# Altium project AT Guard Simple.PrjPcb
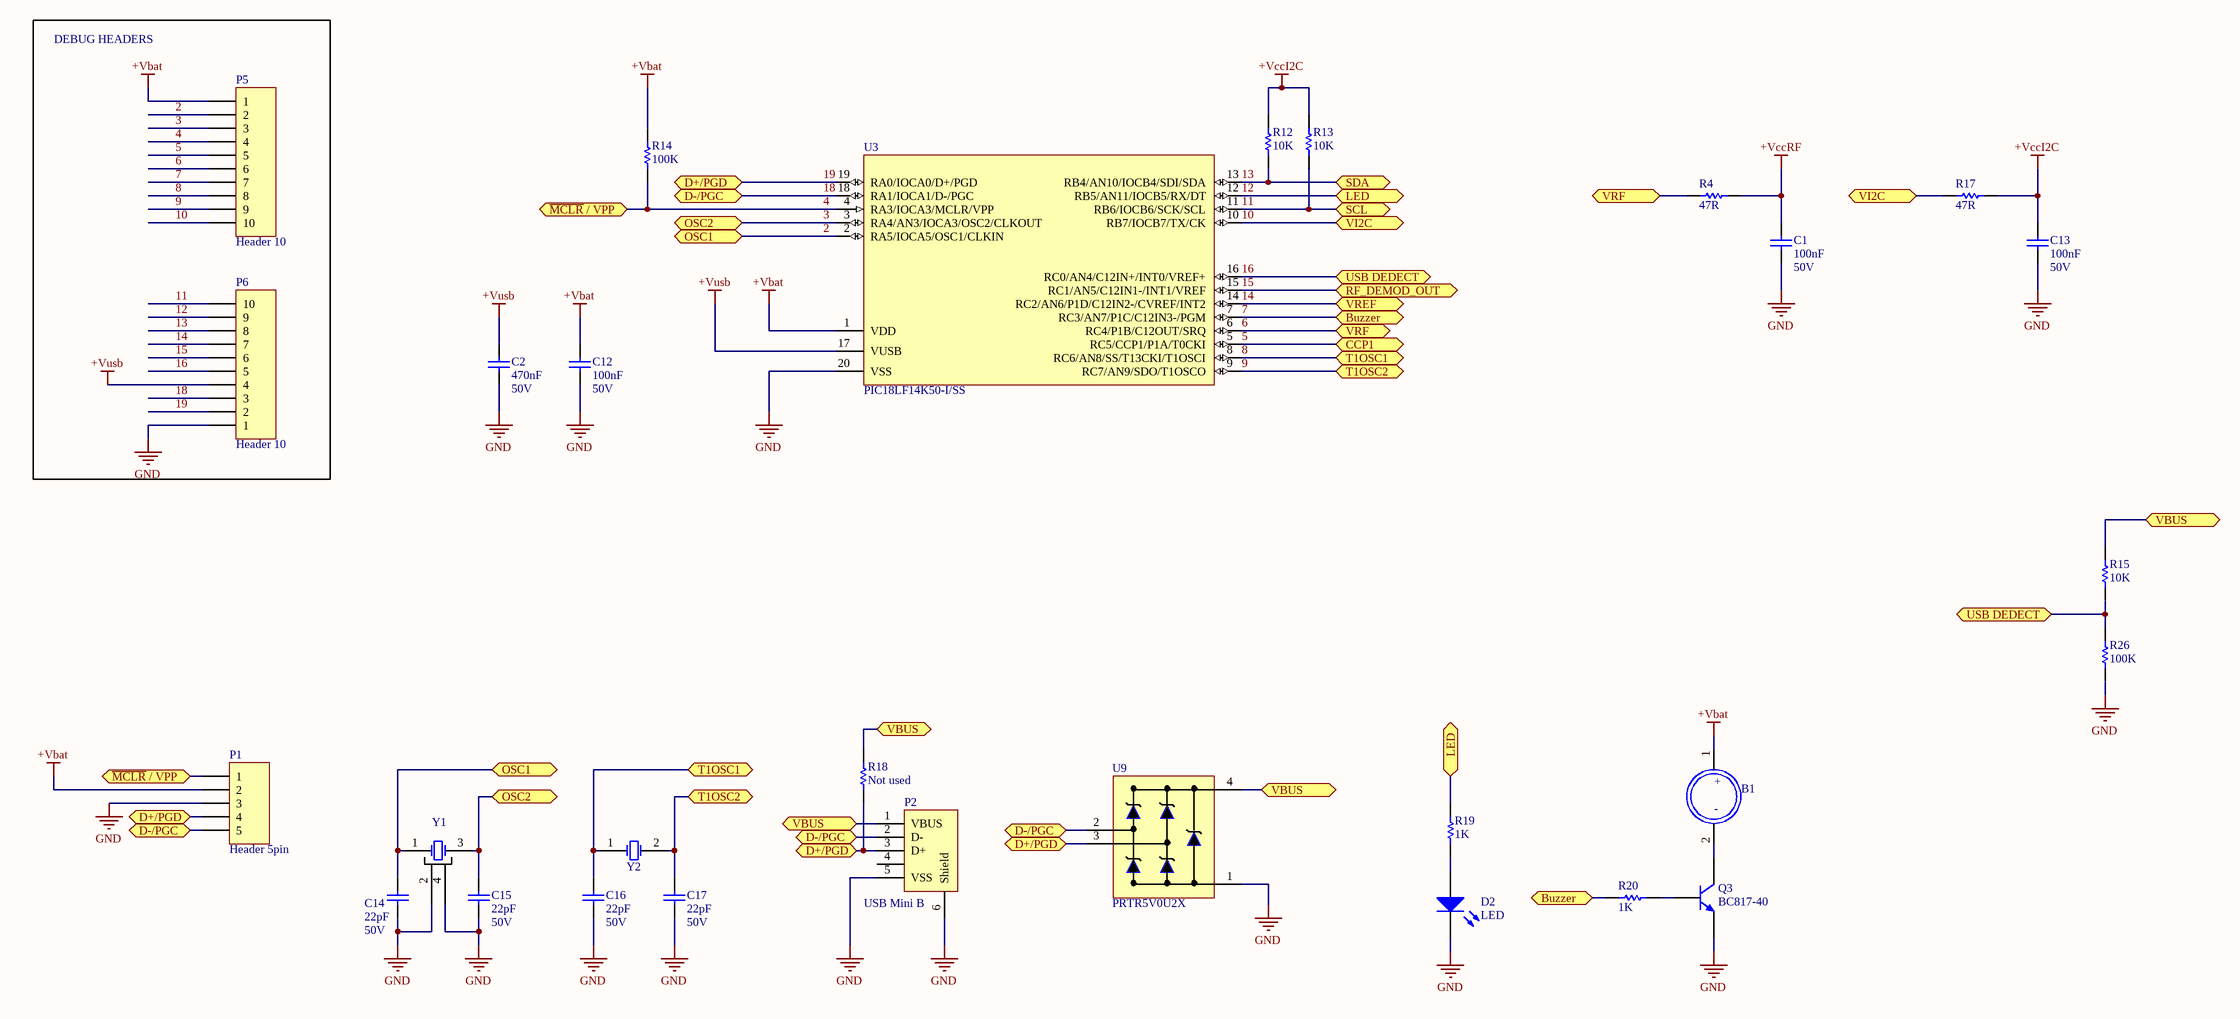
[diagram p0: AT Guard Simple Main.SchDoc]
6 sheets, 82 parts. Net scope: flat (ports and power ports of the same name join across sheets).
Board files: ATGuard Simple V52.PcbDoc, ATGuard Simple V52 Panel.PcbDoc
Sheets:
  AT Guard Simple Main.SchDoc
  RF_125KHz.SchDoc
  AT Guard Simple Power.SchDoc
  AT Guard Simple RTC.SchDoc
  AT Guard Simple Memory.SchDoc
  AT Guard Simple Mems.SchDoc

## Sheet AT Guard Simple Main.SchDoc
size C

### Parts
B1  Buzzer 5V r=12mm, h=7.5 mm  [Buzzer 9x5.5 mm]  (value not drawn)
C1  value 100nF  Voltage: 50V  [3-0603_N]  (hidden comment: Cap)
C2  value 470nF  Voltage: 50V  [3-0603_L]  (hidden comment: Cap)
C12  value 100nF  Voltage: 50V  [3-0603_L]  (hidden comment: Cap)
C13  value 100nF  Voltage: 50V  [3-0603_L]  (hidden comment: Cap)
C14  value 22pF  Voltage: 50V  [3-0603_L]  (hidden comment: Cap)
C15  value 22pF  Voltage: 50V  [3-0603_L]  (hidden comment: Cap)
C16  value 22pF  Voltage: 50V  [3-0603_L]  (hidden comment: Cap)
C17  value 22pF  Voltage: 50V  [3-0603_L]  (hidden comment: Cap)
D2  LED  [6-0805 - LED]
P1  Header 5pin  [Header 1.27mm 5P]
P2  USB Mini B  [USB Mini B Female_N 2]
P5  Header 10  [Header 1.27mm 10P]
P6  Header 10  [Header 1.27mm 10P]
Q3  BC817-40  [SOT23_N]
R4  value 47R  [3-0603_N]  (hidden comment: Res1)
R12  value 10K  [3-0603_L]  (hidden comment: Res1)
R13  value 10K  [3-0603_L]  (hidden comment: Res1)
R14  value 100K  [3-0603_L]  (hidden comment: Res1)
R15  value 10K  [3-0603_L]  (hidden comment: Res1)
R17  value 47R  [3-0603_L]  (hidden comment: Res1)
R18  value Not used  [3-0603_L]  (hidden comment: Res1)
R19  value 1K  [3-0603_L]  (hidden comment: Res1)
R20  value 1K  [3-0603_L]  (hidden comment: Res1)
R26  value 100K  [3-0603_L]  (hidden comment: Res1)
U3  PIC18LF14K50-I/SS  [SSOP-20]
U9  PRTR5V0U2X  [SOT-143B]
Y1  Crystal Oscillator  [4x2.5mm & 3.2x2.5 mm SMD CRYSTAL - duplicate]  (value not drawn)
Y2  XTAL_SMT  [32768 SMT 2.1x6.2mm Crystal]  (value not drawn)

### Blocks framed on the sheet
DEBUG HEADERS: P5 P6

### Ports
Buzzer (bidir), CCP1 (bidir), D+/PGD (bidir), D-/PGC (bidir), LED (bidir), OSC1 (bidir), OSC2 (bidir), RF_DEMOD_OUT (bidir), SCL (bidir), SDA (bidir), T1OSC1 (bidir), T1OSC2 (bidir), USB DEDECT (bidir), VBUS, VI2C (bidir), VREF (bidir), VRF (bidir), ~{MCLR} / VPP (bidir)

### Nets
+Vbat: B1.1 C12.2 P1.2 P5.1 R14.2 U3.1(VDD)
+VccI2C: C13.2 R12.2 R13.2 R17.2
+VccRF: C1.2 R4.2
+Vusb: C2.2 P6.4 U3.17(VUSB)
GND: C1.1 C2.1 C12.1 C13.1 C14.1 C15.1 C16.1 C17.1 D2.2(K) P1.3 P2.5(VSS) P2.6(Shield) P6.1 Q3.2(E) R26.1 U3.20(VSS) U9.1 Y1.2(GND) Y1.4(GND)
2: C14.2 P5.2 U3.2(RA5/IOCA5/OSC1/CLKIN) Y1.1(OSC1) ; port OSC1
3: C15.2 P5.3 U3.3(RA4/AN3/IOCA3/OSC2/CLKOUT) Y1.3(OSC2) ; port OSC2
4: P1.1 P5.4 R14.1 U3.4(RA3/IOCA3/MCLR/VPP) ; port ~{MCLR} / VPP
5: P5.5 U3.5(RC5/CCP1/P1A/T0CKI) ; port CCP1
6: P5.6 R4.1 U3.6(RC4/P1B/C12OUT/SRQ) ; port VRF
7: P5.7 R20.2 U3.7(RC3/AN7/P1C/C12IN3-/PGM) ; port Buzzer
8: C16.2 P5.8 U3.8(RC6/AN8/SS/T13CKI/T1OSCI) Y2.1(OSC1) ; port T1OSC1
9: C17.2 P5.9 U3.9(RC7/AN9/SDO/T1OSCO) Y2.2(OSC2) ; port T1OSC2
10: P5.10 R17.1 U3.10(RB7/IOCB7/TX/CK) ; port VI2C
11: P6.10 R13.1 U3.11(RB6/IOCB6/SCK/SCL) ; port SCL
12: P6.9 R19.2 U3.12(RB5/AN11/IOCB5/RX/DT) ; port LED
13: P6.8 R12.1 U3.13(RB4/AN10/IOCB4/SDI/SDA) ; port SDA
14: P6.7 U3.14(RC2/AN6/P1D/C12IN2-/CVREF/INT2) ; port VREF
15: P6.6 U3.15(RC1/AN5/C12IN1-/INT1/VREF) ; port RF_DEMOD_OUT
16: P6.5 R15.1 R26.2 U3.16(RC0/AN4/C12IN+/INT0/VREF+) ; port USB DEDECT
18: P1.5 P2.2(D-) P6.3 U3.18(RA1/IOCA1/D-/PGC) U9.2 ; port D-/PGC
19: P1.4 P2.3(D+) P6.2 R18.1 U3.19(RA0/IOCA0/D+/PGD) U9.3 ; port D+/PGD
NetB1_2: B1.2 Q3.3(C)
NetD2_1: D2.1(A) R19.1
NetD5_1: P2.1(VBUS) R15.2 R18.2 U9.4 ; port VBUS
NetQ3_1: Q3.1(B) R20.1

Not connected (* = marked no-connect by the designer): P2 4

### Notes on the sheet
- (in symbol Buzzer_) +; -

### Library data of the parts
B1 = Buzzer_
C1 C2 C12-C17 = Cap: Capacitor; Published: 8-Jun-2000; Revision: July-2002: Re-released for DXP Platform.; Publisher: Altium Limited
D2 = LED: Typical INFRARED GaAs LED; Published: 8-Jun-2000; LatestRevisionDate: 08-Jul-2005; LatestRevisionNote: Mech Layer 1 removed.; PackageReference: LED-0; Publisher: Altium Limited
P1 = Header 5 pin: Header 5-Pin; LatestRevisionDate: 17-Jul-2002; LatestRevisionNote: Re-released for DXP Platform.; Publisher: Altium Limited
P5 P6 = Header 10: Header, 10-Pin; LatestRevisionDate: 17-Jul-2002; LatestRevisionNote: Re-released for DXP Platform.; Publisher: Altium Limited
Q3 = BC817-40: NPN General-purpose Transistor; Published: 17-Sep-2003; LatestRevisionDate: 12-Dec-2006; LatestRevisionNote: IPC-7351 Footprint Added.; DatasheetVersion: Jun-1999; PackageVersion: May-1999; PackageReference: SOT23; Publisher: Altium Limited; PackageDescription: 3-Pin SOT-23 Package 0.95 mm Pitch, 2.3 mm Lead Span; ComponentLink1Description: Manufacturer Link; ComponentLink1URL: http://www.semiconductors.philips.com/; ComponentLink2Description: Datasheet; ComponentLink2URL: http://www.semiconductors.philips.com/acrobat/datasheets/BC817_BC817W_BC337_5.pdf
R4 R12-R15 R17-R20 R26 = Res1: Resistor; Published: 8-Jun-2000; LatestRevisionDate: 17-Jul-2002; LatestRevisionNote: Re-released for DXP Platform.; PackageReference: AXIAL-0.3; Publisher: Altium Limited
U3 = PIC18LF14K50-I/SS: High Performance, Enhanced FLASH Microcontroller with 10-Bit A/D and nanoWatt Technology, 8K FLASH, 20-Pin SSOP, Standard Volt Range, Industrial Temperature; Note: OSC1, OSC2, CLKI and CLKO are only available in select Oscillator modes and when these pins are not being used as digital I/O.; Published: 11-Oct-2004; LatestRevisionDate: 04-Mar-2005; LatestRevisionNote: Stylized 3D Model Added.; DatasheetVersion: DS39605B_2002; PackageVersion: 2003; PackageReference: SSOP-20; Publisher: Altium Limited; PackageDescription: SSOP, Plastic; 20 Leads; Body Width 5.3 mm; Pitch 0.65 mm; Code_JEDEC: MO-150; ComponentLink1Description: Manufacturer Link; ComponentLink1URL: http://www.microchip.com; ComponentLink2Description: Datasheet; ComponentLink2URL: http://ww1.microchip.com/downloads/en/DeviceDoc/39605b.pdf; ComponentLink3Description: Packaging Specification; ComponentLink3URL: http://ww1.microchip.com/downloads/en/PackagingSpec/00049AD.pdf
U9 = PRTR5V0U2X: Ultra low capacitance double rail-to-rail ESD protection diode; Published: 13-Oct-2000; LatestRevisionDate: 06-Jun-2005; LatestRevisionNote: Stylized 3D Model Added.; DatasheetVersion: 10-Aug-1999; PackageVersion: 1999; PackageReference: DIP8; Publisher: Altium Limited; PackageDescription: DIP; 8 Leads; Row Spacing 7.62 mm; Pitch 2.54 mm; ComponentLink1Description: Manufacturer Link; ComponentLink1URL: http://www.maxim-ic.com/; ComponentLink2Description: Datasheet; ComponentLink2URL: http://pdfserv.maxim-ic.com/en/ds/DS1307.pdf; ComponentLink3Description: Discontinuation Notice; ComponentLink3URL: http://www.maxim-ic.com/qa/pdfs/non-obsolescence-letter.pdf
Y1 = Crystal Oscillator: Value: 12MHz; Published: 8-Jun-2000; LatestRevisionDate: 17-Jul-2002; LatestRevisionNote: Re-released for DXP Platform.; PackageReference: R38; Publisher: Altium Limited
Y2 = XTAL_SMT: Crystal Oscillator; Published: 8-Jun-2000; LatestRevisionDate: 17-Jul-2002; LatestRevisionNote: Re-released for DXP Platform.; PackageReference: R38; Publisher: Altium Limited
P2 = USB Mini B: LatestRevisionDate: 17-Jul-2002; LatestRevisionNote: Re-released for DXP Platform.; Publisher: Altium Limited

## Sheet RF_125KHz.SchDoc
size D
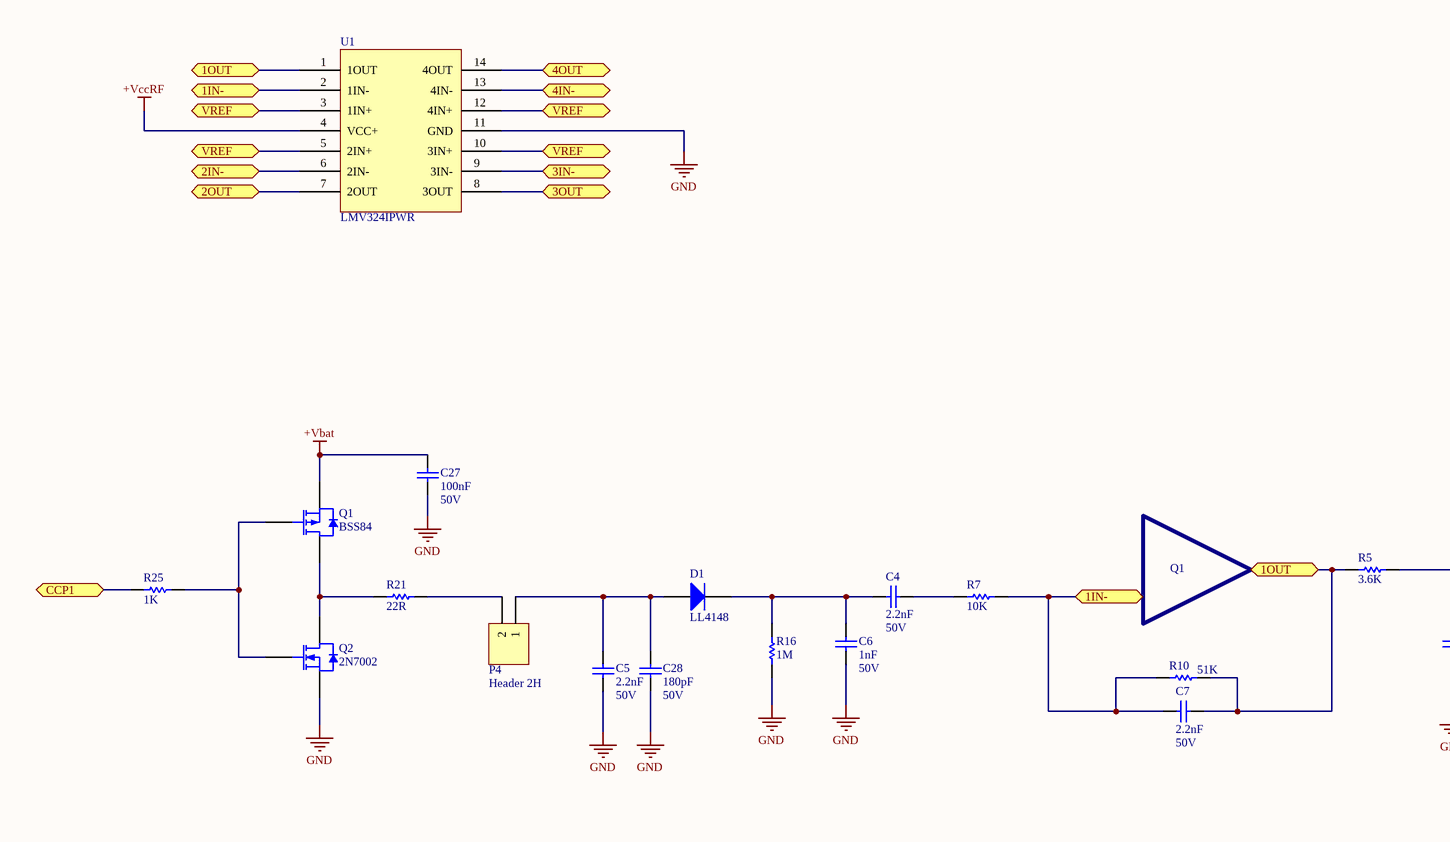
[diagram p1: RF_125KHz.SchDoc, left]
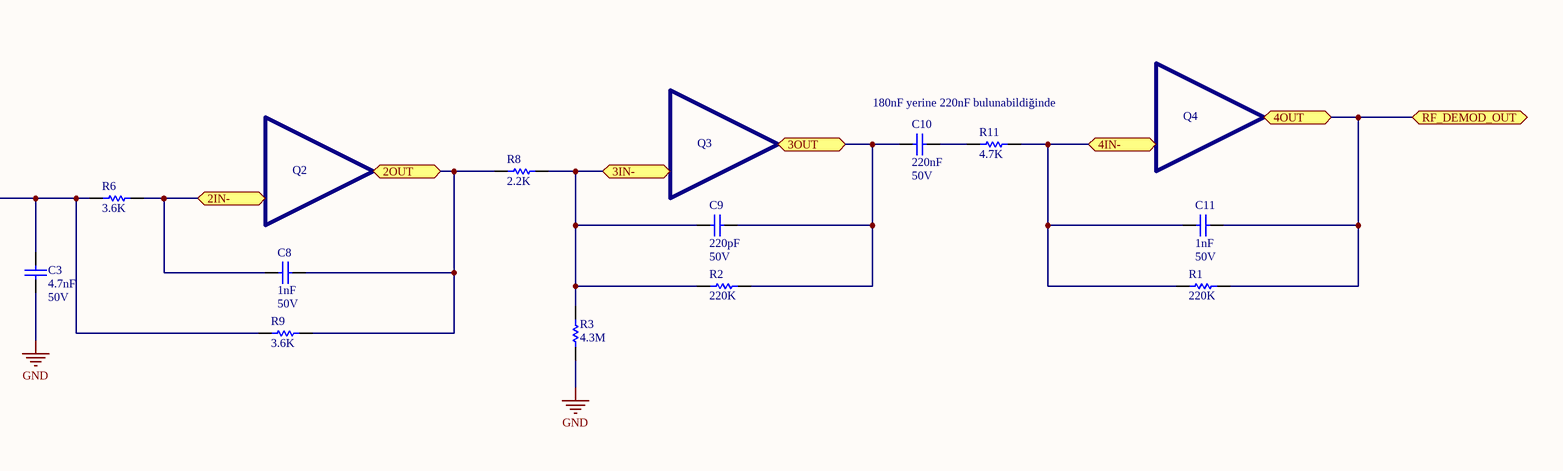
[diagram p2: RF_125KHz.SchDoc, right]

### Parts
C3  value 4.7nF  Voltage: 50V  [6-0805_N]  (hidden comment: Cap)
C4  value 2.2nF  Voltage: 50V  [6-0805_N]  (hidden comment: Cap)
C5  value 2.2nF  Voltage: 50V  [6-0805_N]  (hidden comment: Cap)
C6  value 1nF  Voltage: 50V  [6-0805_N]  (hidden comment: Cap)
C7  value 2.2nF  Voltage: 50V  [6-0805_N]  (hidden comment: Cap)
C8  value 1nF  Voltage: 50V  [6-0805_N]  (hidden comment: Cap)
C9  value 220pF  Voltage: 50V  [6-0805_N]  (hidden comment: Cap)
C10  value 220nF  Voltage: 50V  [6-0805_N]  (hidden comment: Cap)
C11  value 1nF  Voltage: 50V  [6-0805_N]  (hidden comment: Cap)
C27  value 100nF  Voltage: 50V  [3-0603_N]  (hidden comment: Cap)
C28  value 180pF  Voltage: 50V  [6-0805_N]  (hidden comment: Cap)
D1  LL4148  [DL-35 - S]
P4  Header 2H  [HDR1X2H-180 derece]
Q1  BSS84  [SOT23_N]
Q2  2N7002  [SOT23_N]
R1  value 220K  [6-0805_N]  (hidden comment: Res1)
R2  value 220K  [6-0805_N]  (hidden comment: Res1)
R3  value 4.3M  [6-0805_N]  (hidden comment: Res1)
R5  value 3.6K  [6-0805_N]  (hidden comment: Res1)
R6  value 3.6K  [6-0805_N]  (hidden comment: Res1)
R7  value 10K  [6-0805_N]  (hidden comment: Res1)
R8  value 2.2K  [6-0805_N]  (hidden comment: Res1)
R9  value 3.6K  [6-0805_N]  (hidden comment: Res1)
R10  value 51K  [6-0805_N]  (hidden comment: Res1)
R11  value 4.7K  [6-0805_N]  (hidden comment: Res1)
R16  value 1M  [6-0805_N]  (hidden comment: Res1)
R21  value 22R  [6-0805_N]  (hidden comment: Res1)
R25  value 1K  [3-0603_N]  (hidden comment: Res1)
U1  LMV324IPWR  [TSSOP-14N]

### Ports
1IN-, 1OUT, 2IN-, 2OUT, 3IN-, 3OUT, 4IN-, 4OUT (bidir), CCP1 (bidir), RF_DEMOD_OUT (bidir), VREF (bidir)

### Nets
+Vbat: C27.2 Q1.2(S)
+VccRF: U1.4(VCC+)
GND: C3.1 C5.2 C6.2 C27.1 C28.2 Q2.2(S) R3.2 R16.1 U1.11(GND)
5: R25.1 ; port CCP1
14: U1.3(1IN+) U1.5(2IN+) U1.10(3IN+) U1.12(4IN+) ; port VREF
15: C11.2 R1.2 U1.14(4OUT) ; port 4OUT, port RF_DEMOD_OUT
NetC3_2: C3.2 R5.1 R6.2 R9.2
NetC4_1: C4.1 R7.2
NetC4_2: C4.2 C6.1 D1.2(K) R16.2
NetC5_1: C5.1 C28.1 D1.1(A) P4.1
NetC7_1: C7.1 R7.1 R10.2 U1.2(1IN-) ; port 1IN-
NetC7_2: C7.2 R5.2 R10.1 U1.1(1OUT) ; port 1OUT
NetC8_1: C8.1 R6.1 U1.6(2IN-) ; port 2IN-
NetC8_2: C8.2 R8.2 R9.1 U1.7(2OUT) ; port 2OUT
NetC9_1: C9.1 R2.2 R3.1 R8.1 U1.9(3IN-) ; port 3IN-
NetC9_2: C9.2 C10.1 R2.1 U1.8(3OUT) ; port 3OUT
NetC10_2: C10.2 R11.1
NetC11_1: C11.1 R1.1 R11.2 U1.13(4IN-) ; port 4IN-
NetP4_2: P4.2 R21.2
NetQ1_1: Q1.1(G) Q2.1(G) R25.2
NetQ1_3: Q1.3(D) Q2.3(D) R21.1

### Notes on the sheet
- 180nF yerine 220nF bulunabildiğinde
- Q2
- Q3
- Q4
- Q1

### Library data of the parts
C3-C11 C27 C28 = Cap: Capacitor; Published: 8-Jun-2000; Revision: July-2002: Re-released for DXP Platform.; Publisher: Altium Limited
D1 = LL4148: 1 Amp General Purpose Rectifier; Published: 8-Jun-2000; LatestRevisionDate: 17-Jul-2002; LatestRevisionNote: Re-released for DXP Platform.; DatasheetDocument: 1998; PackageDocument: Aug-1999; Publisher: Altium Limited; Code_JEDEC: DO-204-AL; ComponentLink1Description: Manufacturer Link; ComponentLink1URL: http://www.fairchildsemi.com/; ComponentLink2Description: Datasheet; ComponentLink2URL: http://www.fairchildsemi.com/ds/1N%2F1N4001.pdf
P4 = Header 2H: Header, 2-Pin, Right Angle; LatestRevisionDate: 17-Jul-2002; LatestRevisionNote: Re-released for DXP Platform.; Publisher: Altium Limited
Q1 = BSS84: P-channel Enhancement Mode Vertical D-MOSFET; Published: 17-Sep-2003; LatestRevisionDate: 12-Dec-2006; LatestRevisionNote: IPC-7351 Footprint Added.; DatasheetVersion: 18-Jun-1997; PackageVersion: May-1999; PackageReference: SOT23; Publisher: Altium Limited; PackageDescription: 3-Pin SOT-23 Package 0.95 mm Pitch, 2.3 mm Lead Span; ComponentLink1Description: Manufacturer Link; ComponentLink1URL: http://www.semiconductors.philips.com/; ComponentLink2Description: Datasheet; ComponentLink2URL: http://www.semiconductors.philips.com/acrobat/datasheets/BSS84_3.pdf
Q2 = 2N7002: N-channel Enhancement Mode Field-effect Transistor; Published: 17-Sep-2003; LatestRevisionDate: 12-Dec-2006; LatestRevisionNote: IPC-7351 Footprint Added.; DatasheetVersion: 27-Jul-2000; PackageVersion: May-1999; PackageReference: SOT23; Publisher: Altium Limited; PackageDescription: 3-Pin SOT-23 Package 0.95 mm Pitch, 2.3 mm Lead Span; ComponentLink1Description: Manufacturer Link; ComponentLink1URL: http://www.semiconductors.philips.com/; ComponentLink2Description: Datasheet; ComponentLink2URL: http://www.semiconductors.philips.com/acrobat/datasheets/2N7002_4.pdf
R1-R3 R5-R11 R16 R21 R25 = Res1: Resistor; Published: 8-Jun-2000; LatestRevisionDate: 17-Jul-2002; LatestRevisionNote: Re-released for DXP Platform.; PackageReference: AXIAL-0.3; Publisher: Altium Limited
U1 = LMV324IPWR: IC OPAMP GP R-R 1MHZ 14TSSOP; Manufacturer: Texas Instruments; .Checked PCB: *; .Checked SCH: *; Category: Integrated Circuits (ICs); Digi-Key Part Number: 296-9570-2-ND; Manufacturer Part Number: LMV324IPWR; Package / Case: 14-TSSOP (0.173", 4.40mm Width); Family: Linear - Amplifiers - Instrumentation, OP Amps, Buffer Amps; Price 1k [$]: 0.14375; Standard Package: 2000

## Sheet AT Guard Simple Power.SchDoc
size A
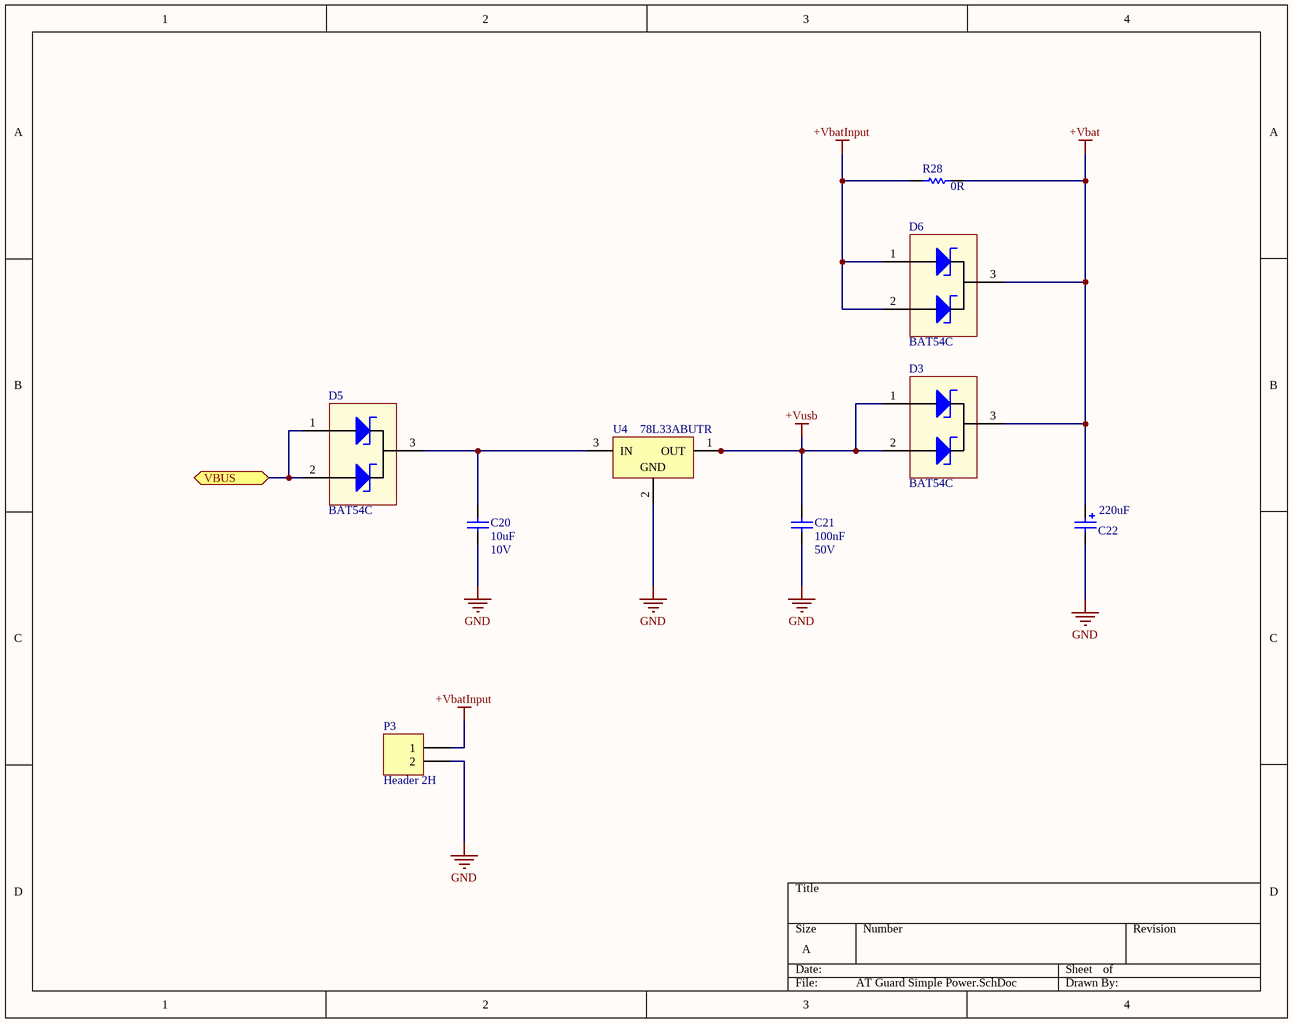
[diagram p3: AT Guard Simple Power.SchDoc]

### Parts
C20  value 10uF  Voltage: 10V  [3-0603_L]  (hidden comment: Cap)
C21  value 100nF  Voltage: 50V  [3-0603_L]  (hidden comment: Cap)
C22  value 220uF  [C]  (hidden comment: CAP-Tantal)
D3  BAT54C  [SOT23_N]
D5  BAT54C  [SOT23_N]
D6  BAT54C  [SOT23_N]
P3  Header 2H  [HDR1X2H-180 derece]
R28  value 0R  [6-0805_N]  (hidden comment: Res1)
U4  78L33ABUTR  [SOT89M]

### Ports
VBUS

### Nets
+Vbat: C22.1 D3.3(A) D6.3(A) R28.2
+VbatInput: D6.1(K1) D6.2(K2) P3.1 R28.1
+Vusb: C21.2 D3.1(K1) D3.2(K2) U4.1(OUT)
GND: C20.1 C21.1 C22.2 P3.2 U4.2(GND)
NetC20_2: C20.2 D5.3(A) U4.3(IN)
NetD5_1: D5.1(K1) D5.2(K2) ; port VBUS

### Library data of the parts
C20 C21 = Cap: Capacitor; Published: 8-Jun-2000; Revision: July-2002: Re-released for DXP Platform.; Publisher: Altium Limited
C22 = CAP-Tantal: Tantamount Military, Surface Mount MIL-PRF-55365/8 Qualified Solid Tantalum Chip Capacitor: 6.8uF, 20% Tolerance, 6 WVDC @ +85°C, Surge = 8V; Note: See Data Sheet for full range of components; Voltage: 6.3V; Published: 19-Mar-2004; DatasheetDocument: 20-Mar-2003; PackageReference: 3528; Publisher: Altium Limited; Code_JEITA: 3528; ComponentLink1Description: Manufacturer Link; ComponentLink1URL: http://www.vishay.com/; ComponentLink2Description: Datasheet; ComponentLink2URL: http://www.vishay.com/docs/40011/cwr11.pdf
D3 D5 D6 = BAT54C: 2x200 mA Shottky Rectifier; Published: 8-Jun-2000; LatestRevisionDate: 17-Jul-2002; LatestRevisionNote: Re-released for DXP Platform.; DatasheetDocument: 1998; PackageDocument: Aug-1999; PackageReference: DO-41; Publisher: Altium Limited; Code_JEDEC: DO-204-AL; ComponentLink1Description: Manufacturer Link; ComponentLink1URL: http://www.fairchildsemi.com/; ComponentLink2Description: Datasheet; ComponentLink2URL: http://www.fairchildsemi.com/ds/1N%2F1N4001.pdf
P3 = Header 2H: Header, 2-Pin, Right Angle; LatestRevisionDate: 17-Jul-2002; LatestRevisionNote: Re-released for DXP Platform.; Publisher: Altium Limited
R28 = Res1: Resistor; Published: 8-Jun-2000; LatestRevisionDate: 17-Jul-2002; LatestRevisionNote: Re-released for DXP Platform.; PackageReference: AXIAL-0.3; Publisher: Altium Limited
U4 = 78L33ABUTR: Precision 500mA Regulator; Published: 24-Aug-2001; LatestRevisionDate: 06-Jun-2005; LatestRevisionNote: PCB pads lengthened.; DatasheetVersion: Mar-1997; PackageVersion: Jun-2004; PackageReference: TO-252; Publisher: Altium Limited; PackageDescription: D-PAK/TO-252-AA; 3 Leads (1 Cropped); Body 10.1 (inc. leads) x 6.6 mm (LxW max); ComponentLink1Description: Manufacturer Link; ComponentLink1URL: http://www.st.com/; ComponentLink2Description: Datasheet; ComponentLink2URL: http://www.st.com/stonline/products/literature/ds/2147/l78m05ab.pdf

## Sheet AT Guard Simple RTC.SchDoc
size A4
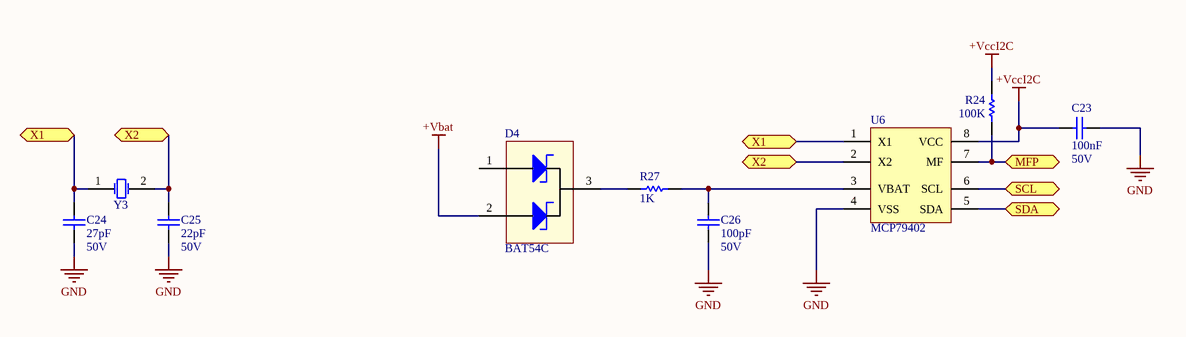
[diagram p4: AT Guard Simple RTC.SchDoc]

### Parts
C23  value 100nF  Voltage: 50V  [3-0603_L]  (hidden comment: Cap)
C24  value 27pF  Voltage: 50V  [3-0603_L]  (hidden comment: Cap)
C25  value 22pF  Voltage: 50V  [3-0603_L]  (hidden comment: Cap)
C26  value 100pF  Voltage: 50V  [3-0603_L]  (hidden comment: Cap)
D4  BAT54C  [SOT23_N]
R24  value 100K  [3-0603_L]  (hidden comment: Res1)
R27  value 1K  [3-0603_L]  (hidden comment: Res1)
U6  MCP79402  [TSSOP-ST8_M]
Y3  XTAL_SMT  [32768 SMT 2.1x6.2mm Crystal]  (value not drawn)

### Ports
MFP (bidir), SCL (bidir), SDA (bidir), X1, X2

### Nets
+Vbat: D4.2(K2)
+VccI2C: C23.1 R24.1 U6.8(VCC)
GND: C23.2 C24.1 C25.1 C26.1 U6.4(VSS)
11: U6.6(SCL) ; port SCL
13: U6.5(SDA) ; port SDA
NetC24_2: C24.2 U6.1(X1) Y3.1(OSC1) ; port X1
NetC25_2: C25.2 U6.2(X2) Y3.2(OSC2) ; port X2
NetC26_2: C26.2 R27.2 U6.3(VBAT)
NetD4_3: D4.3(A) R27.1
NetR24_2: R24.2 U6.7(MF) ; port MFP

Not connected (* = marked no-connect by the designer): D4 1(K1)

### Library data of the parts
C23-C26 = Cap: Capacitor; Published: 8-Jun-2000; Revision: July-2002: Re-released for DXP Platform.; Publisher: Altium Limited
D4 = BAT54C: 2x200 mA Shottky Rectifier; Published: 8-Jun-2000; LatestRevisionDate: 17-Jul-2002; LatestRevisionNote: Re-released for DXP Platform.; DatasheetDocument: 1998; PackageDocument: Aug-1999; PackageReference: DO-41; Publisher: Altium Limited; Code_JEDEC: DO-204-AL; ComponentLink1Description: Manufacturer Link; ComponentLink1URL: http://www.fairchildsemi.com/; ComponentLink2Description: Datasheet; ComponentLink2URL: http://www.fairchildsemi.com/ds/1N%2F1N4001.pdf
R24 R27 = Res1: Resistor; Published: 8-Jun-2000; LatestRevisionDate: 17-Jul-2002; LatestRevisionNote: Re-released for DXP Platform.; PackageReference: AXIAL-0.3; Publisher: Altium Limited
U6 = MCP79402: MCP79402 RTC,I2C; Published: 29-Jan-2009; DatasheetVersion: revE, Mar-2007; PackageVersion: revAW, Oct-2008; PackageReference: SOIJ-SM8; Publisher: Altium Limited; PackageDescription: 8-Lead Plastic Small Outline (SM) - Medium, 5.28 mm Body [SOIJ]; ComponentLink1Description: Manufacturer Link; ComponentLink1URL: http://www.microchip.com; ComponentLink2Description: Datasheet; ComponentLink2URL: http://ww1.microchip.com/downloads/en/DeviceDoc/21941E.pdf; ComponentLink3Description: Packaging Specification; ComponentLink3URL: http://ww1.microchip.com/downloads/en/PackagingSpec/00049AW.pdf
Y3 = XTAL_SMT: Crystal Oscillator; Published: 8-Jun-2000; LatestRevisionDate: 17-Jul-2002; LatestRevisionNote: Re-released for DXP Platform.; PackageReference: R38; Publisher: Altium Limited

## Sheet AT Guard Simple Memory.SchDoc
size A4
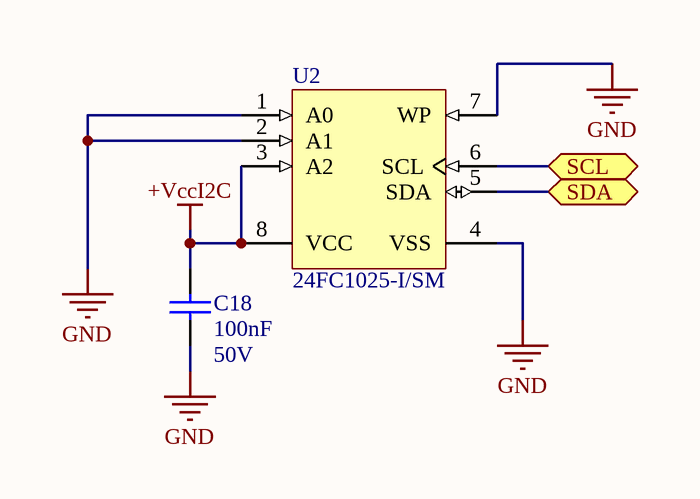
[diagram p5: AT Guard Simple Memory.SchDoc]

### Parts
C18  value 100nF  Voltage: 50V  [3-0603_L]  (hidden comment: Cap)
U2  24FC1025-I/SM  [SOIJ-SM8_N]

### Ports
SCL (bidir), SDA (bidir)

### Nets
+VccI2C: C18.2 U2.3(A2) U2.8(VCC)
GND: C18.1 U2.1(A0) U2.2(A1) U2.4(VSS) U2.7(WP)
11: U2.6(SCL) ; port SCL
13: U2.5(SDA) ; port SDA

### Library data of the parts
C18 = Cap: Capacitor; Published: 8-Jun-2000; Revision: July-2002: Re-released for DXP Platform.; Publisher: Altium Limited
U2 = 24FC1025-I/SM: 1 Mbit, 1MHz, 2.5V, I2C Serial EEPROM, 8-Pin SOIC 208mil, Industrial Temperature; Published: 29-Jan-2009; DatasheetVersion: revE, Mar-2007; PackageVersion: revAW, Oct-2008; PackageReference: SOIJ-SM8; Publisher: Altium Limited; PackageDescription: 8-Lead Plastic Small Outline (SM) - Medium, 5.28 mm Body [SOIJ]; ComponentLink1Description: Manufacturer Link; ComponentLink1URL: http://www.microchip.com; ComponentLink2Description: Datasheet; ComponentLink2URL: http://ww1.microchip.com/downloads/en/DeviceDoc/21941E.pdf; ComponentLink3Description: Packaging Specification; ComponentLink3URL: http://ww1.microchip.com/downloads/en/PackagingSpec/00049AW.pdf

## Sheet AT Guard Simple Mems.SchDoc
size A4
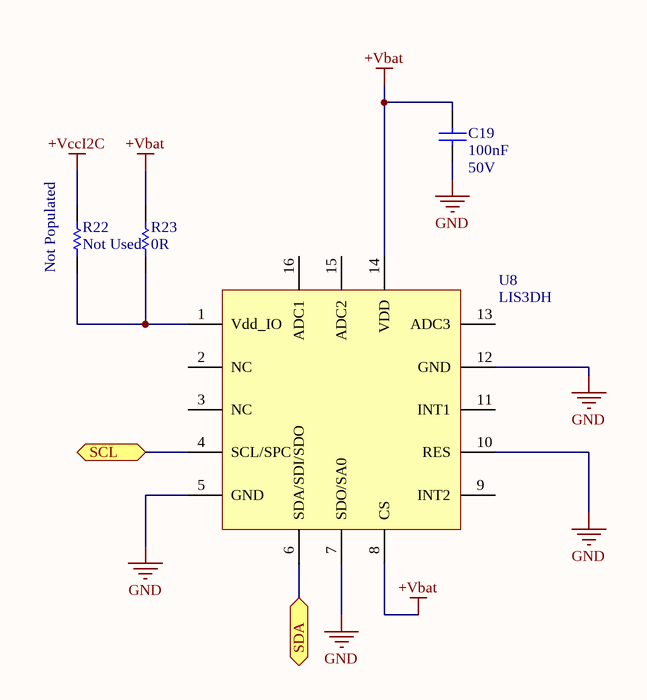
[diagram p6: AT Guard Simple Mems.SchDoc]

### Parts
C19  value 100nF  Voltage: 50V  [3-0603_L]  (hidden comment: Cap)
R22  value Not Used  [3-0603_L]  (hidden comment: Res1)
R23  value 0R  [3-0603_L]  (hidden comment: Res1)
U8  LIS3DH  [LGA 16]

### Ports
SCL (bidir), SDA (bidir)

### Nets
+Vbat: C19.1 R23.1 U8.8(CS) U8.14(VDD)
+VccI2C: R22.1
GND: C19.2 U8.5(GND) U8.7(SDO/SA0) U8.10(RES) U8.12(GND)
11: U8.4(SCL/SPC) ; port SCL
13: U8.6(SDA/SDI/SDO) ; port SDA
NetR22_2: R22.2 R23.2 U8.1(Vdd_IO)

Not connected (* = marked no-connect by the designer): U8 2(NC) 3(NC) 9(INT2) 11(INT1) 13(ADC3) 15(ADC2) 16(ADC1)

### Notes on the sheet
- (near R22) Not Populated

### Library data of the parts
C19 = Cap: Capacitor; Published: 8-Jun-2000; Revision: July-2002: Re-released for DXP Platform.; Publisher: Altium Limited
R22 R23 = Res1: Resistor; Published: 8-Jun-2000; LatestRevisionDate: 17-Jul-2002; LatestRevisionNote: Re-released for DXP Platform.; PackageReference: AXIAL-0.3; Publisher: Altium Limited
U8 = LIS3DH: 3-axis - ±2g analog output “nano” accelerometer; FirstPublished: 29-Jan-2009; LatestRevisionDate: 27-Nov-2009; LatestRevisionNote: Updated to datasheet revision B, May-2009; DatasheetVersion: revB, May-2009; PackageVersion: revBB, Aug-2009; PackageReference: QFN-ML20; Publisher: Altium Limited; PackageDescription: 20-Lead Plastic Quad Flat, No Lead Package (ML) - 4x4x0.9 mm Body [QFN]; ComponentLink1Description: Datasheet; ComponentLink1URL: http://ww1.microchip.com/downloads/en/DeviceDoc/22090b.pdf; ComponentLink2Description: Packaging Specification; ComponentLink2URL: http://www.microchip.com/stellent/groups/techpub_sg/documents/packagingspec/en012702.pdf; ComponentLink3Description: Microchip.com Home; ComponentLink3URL: http://www.microchip.com/

## Nets that join several sheets
+Vbat: AT Guard Simple Main (6 pins), RF_125KHz (C27.2 Q1.2), AT Guard Simple Power (C22.1 D3.3 D6.3 R28.2), AT Guard Simple RTC (D4.2), AT Guard Simple Mems (C19.1 R23.1 U8.8 U8.14)
+VccI2C: AT Guard Simple Main (C13.2 R12.2 R13.2 R17.2), AT Guard Simple RTC (C23.1 R24.1 U6.8), AT Guard Simple Memory (C18.2 U2.3 U2.8), AT Guard Simple Mems (R22.1)
+VccRF: AT Guard Simple Main (C1.2 R4.2), RF_125KHz (U1.4)
+Vusb: AT Guard Simple Main (C2.2 P6.4 U3.17), AT Guard Simple Power (C21.2 D3.1 D3.2 U4.1)
GND: AT Guard Simple Main (19 pins), RF_125KHz (9 pins), AT Guard Simple Power (5 pins), AT Guard Simple RTC (5 pins), AT Guard Simple Memory (5 pins), AT Guard Simple Mems (5 pins)
5: AT Guard Simple Main (P5.5 U3.5), RF_125KHz (R25.1)
11: AT Guard Simple Main (P6.10 R13.1 U3.11), AT Guard Simple RTC (U6.6), AT Guard Simple Memory (U2.6), AT Guard Simple Mems (U8.4)
13: AT Guard Simple Main (P6.8 R12.1 U3.13), AT Guard Simple RTC (U6.5), AT Guard Simple Memory (U2.5), AT Guard Simple Mems (U8.6)
14: AT Guard Simple Main (P6.7 U3.14), RF_125KHz (U1.3 U1.5 U1.10 U1.12)
15: AT Guard Simple Main (P6.6 U3.15), RF_125KHz (C11.2 R1.2 U1.14)
NetD5_1: AT Guard Simple Main (P2.1 R15.2 R18.2 U9.4), AT Guard Simple Power (D5.1 D5.2)